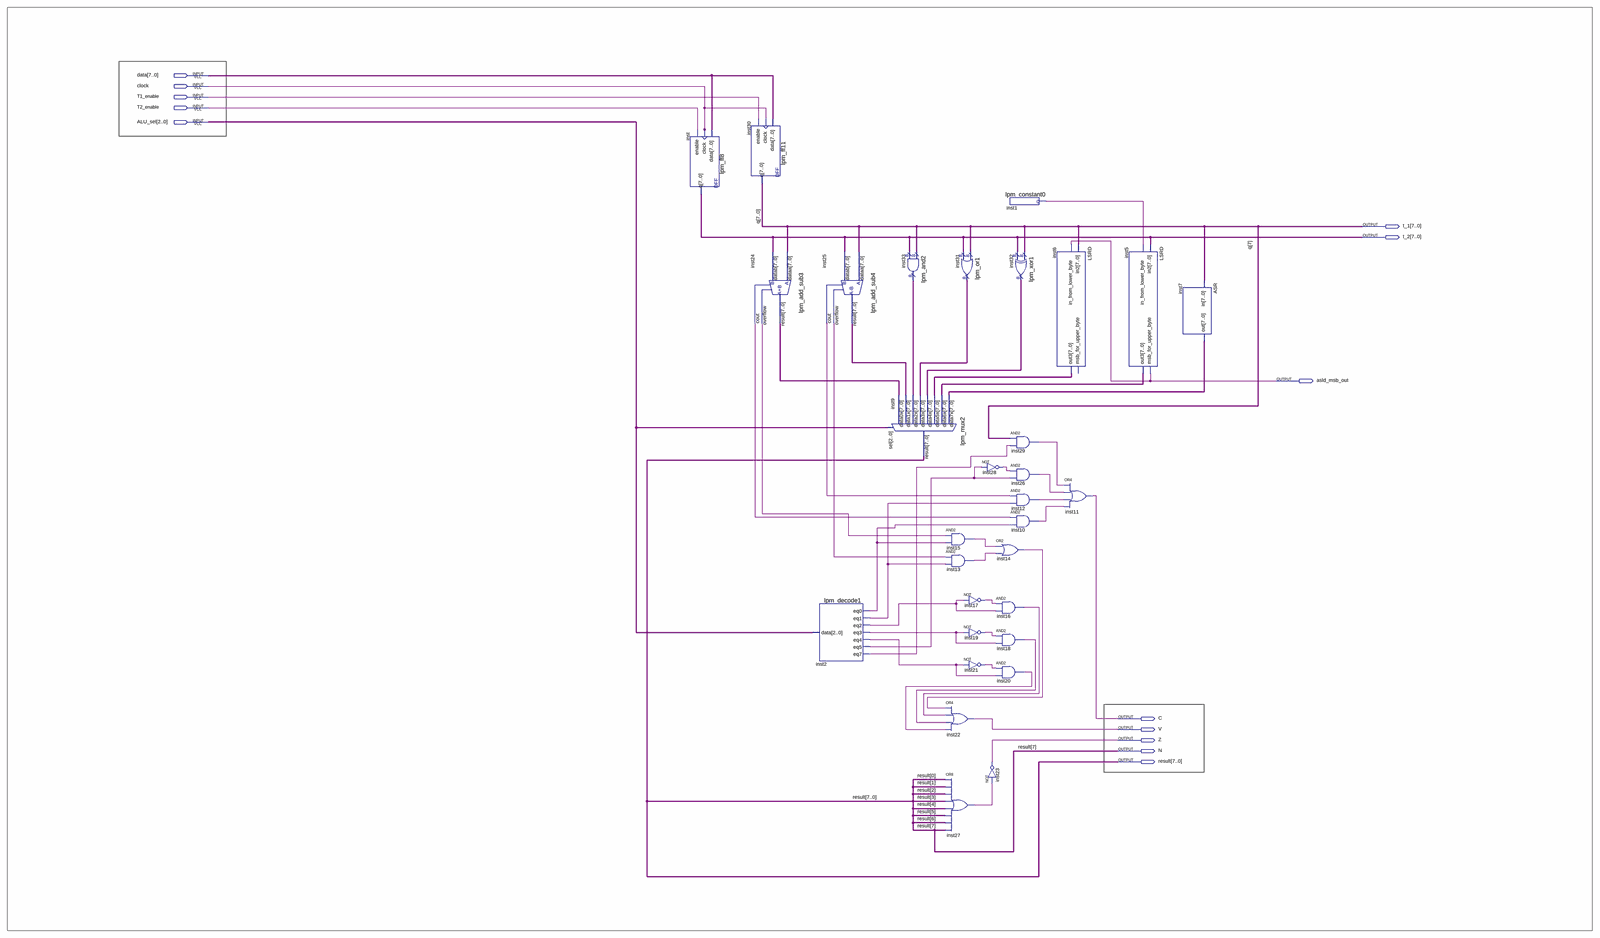
[diagram p0: schematic sheet, whole]
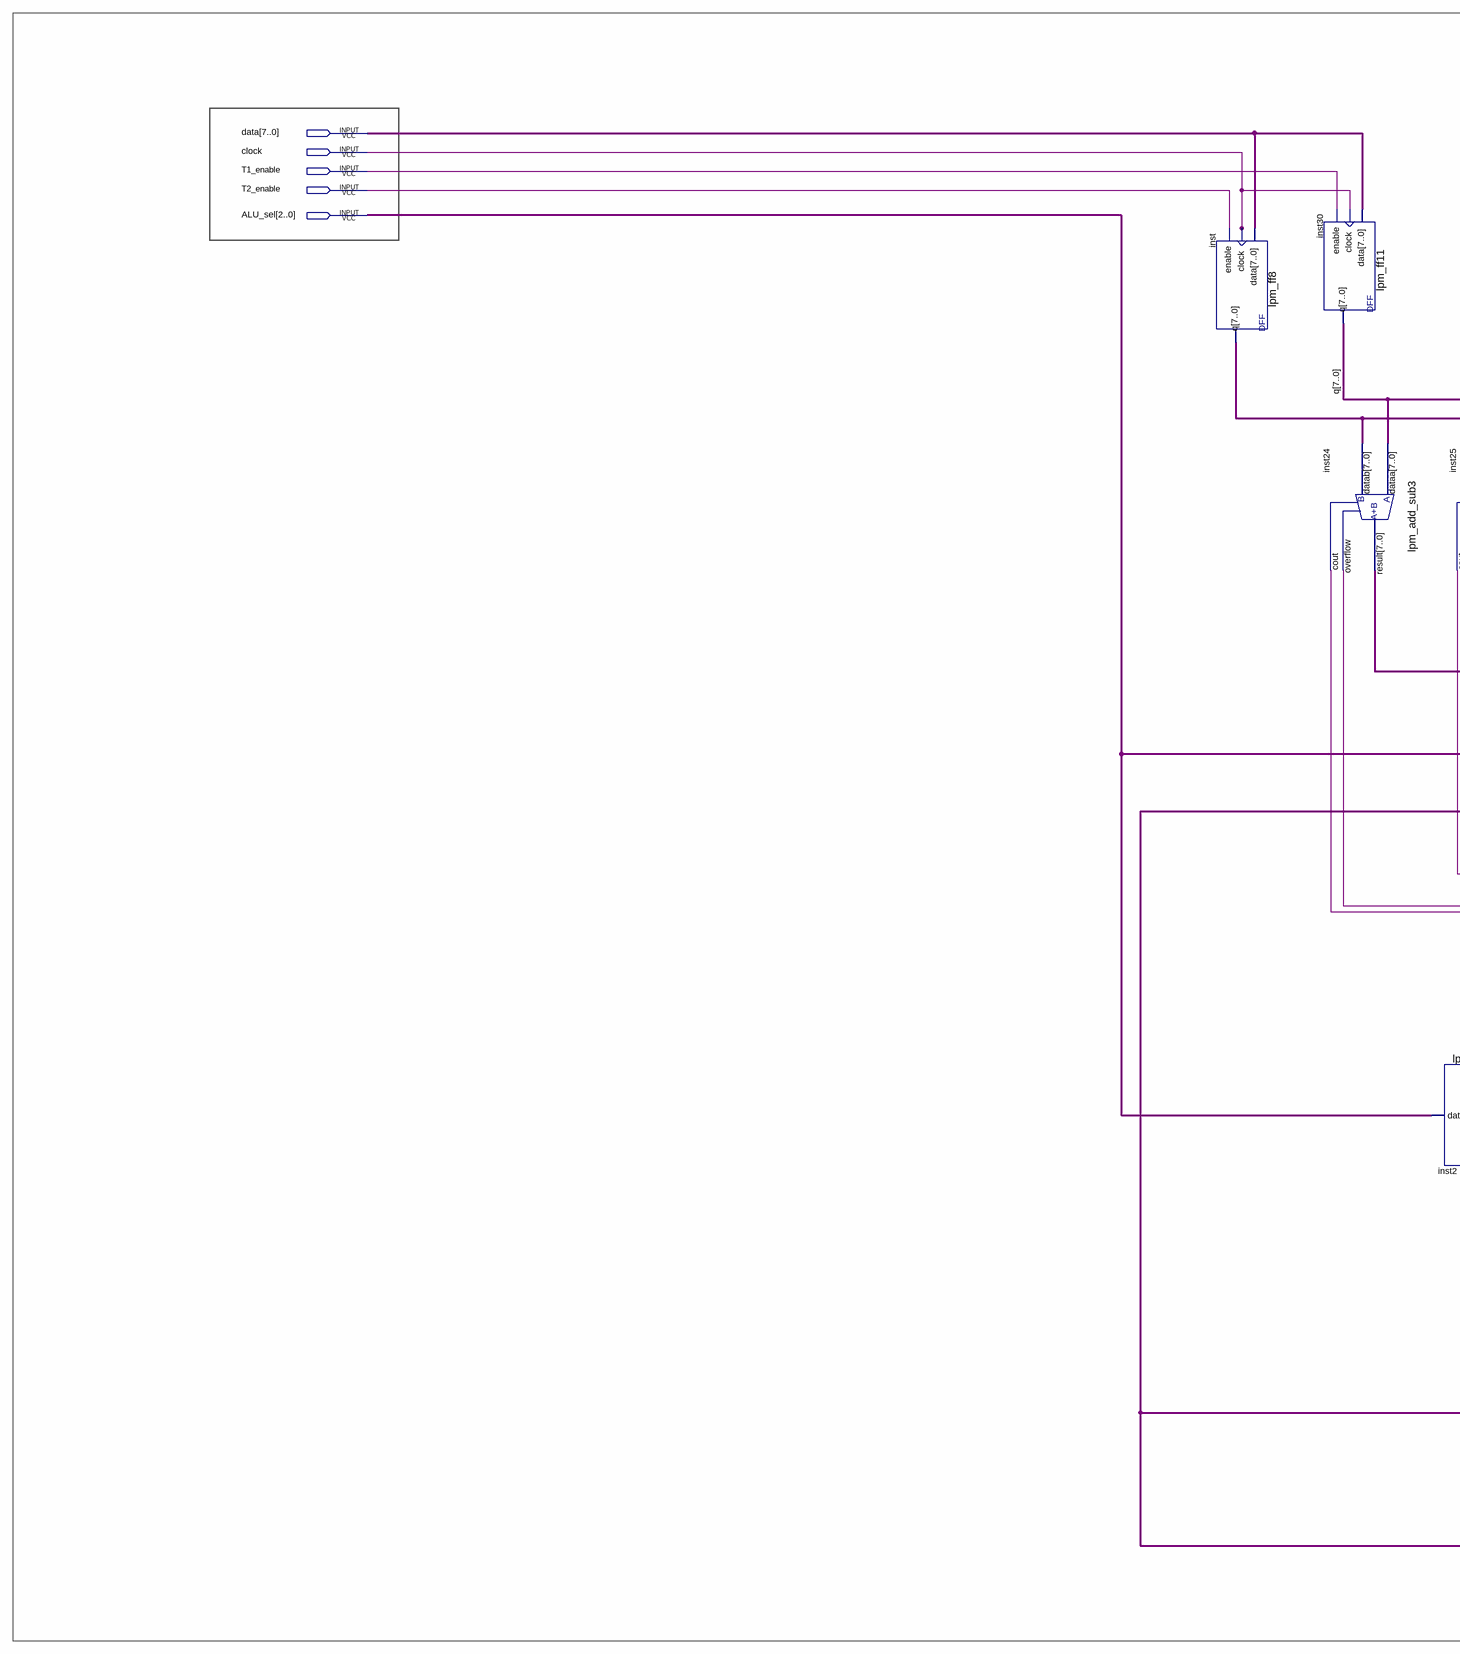
[diagram p1: schematic sheet, left part]
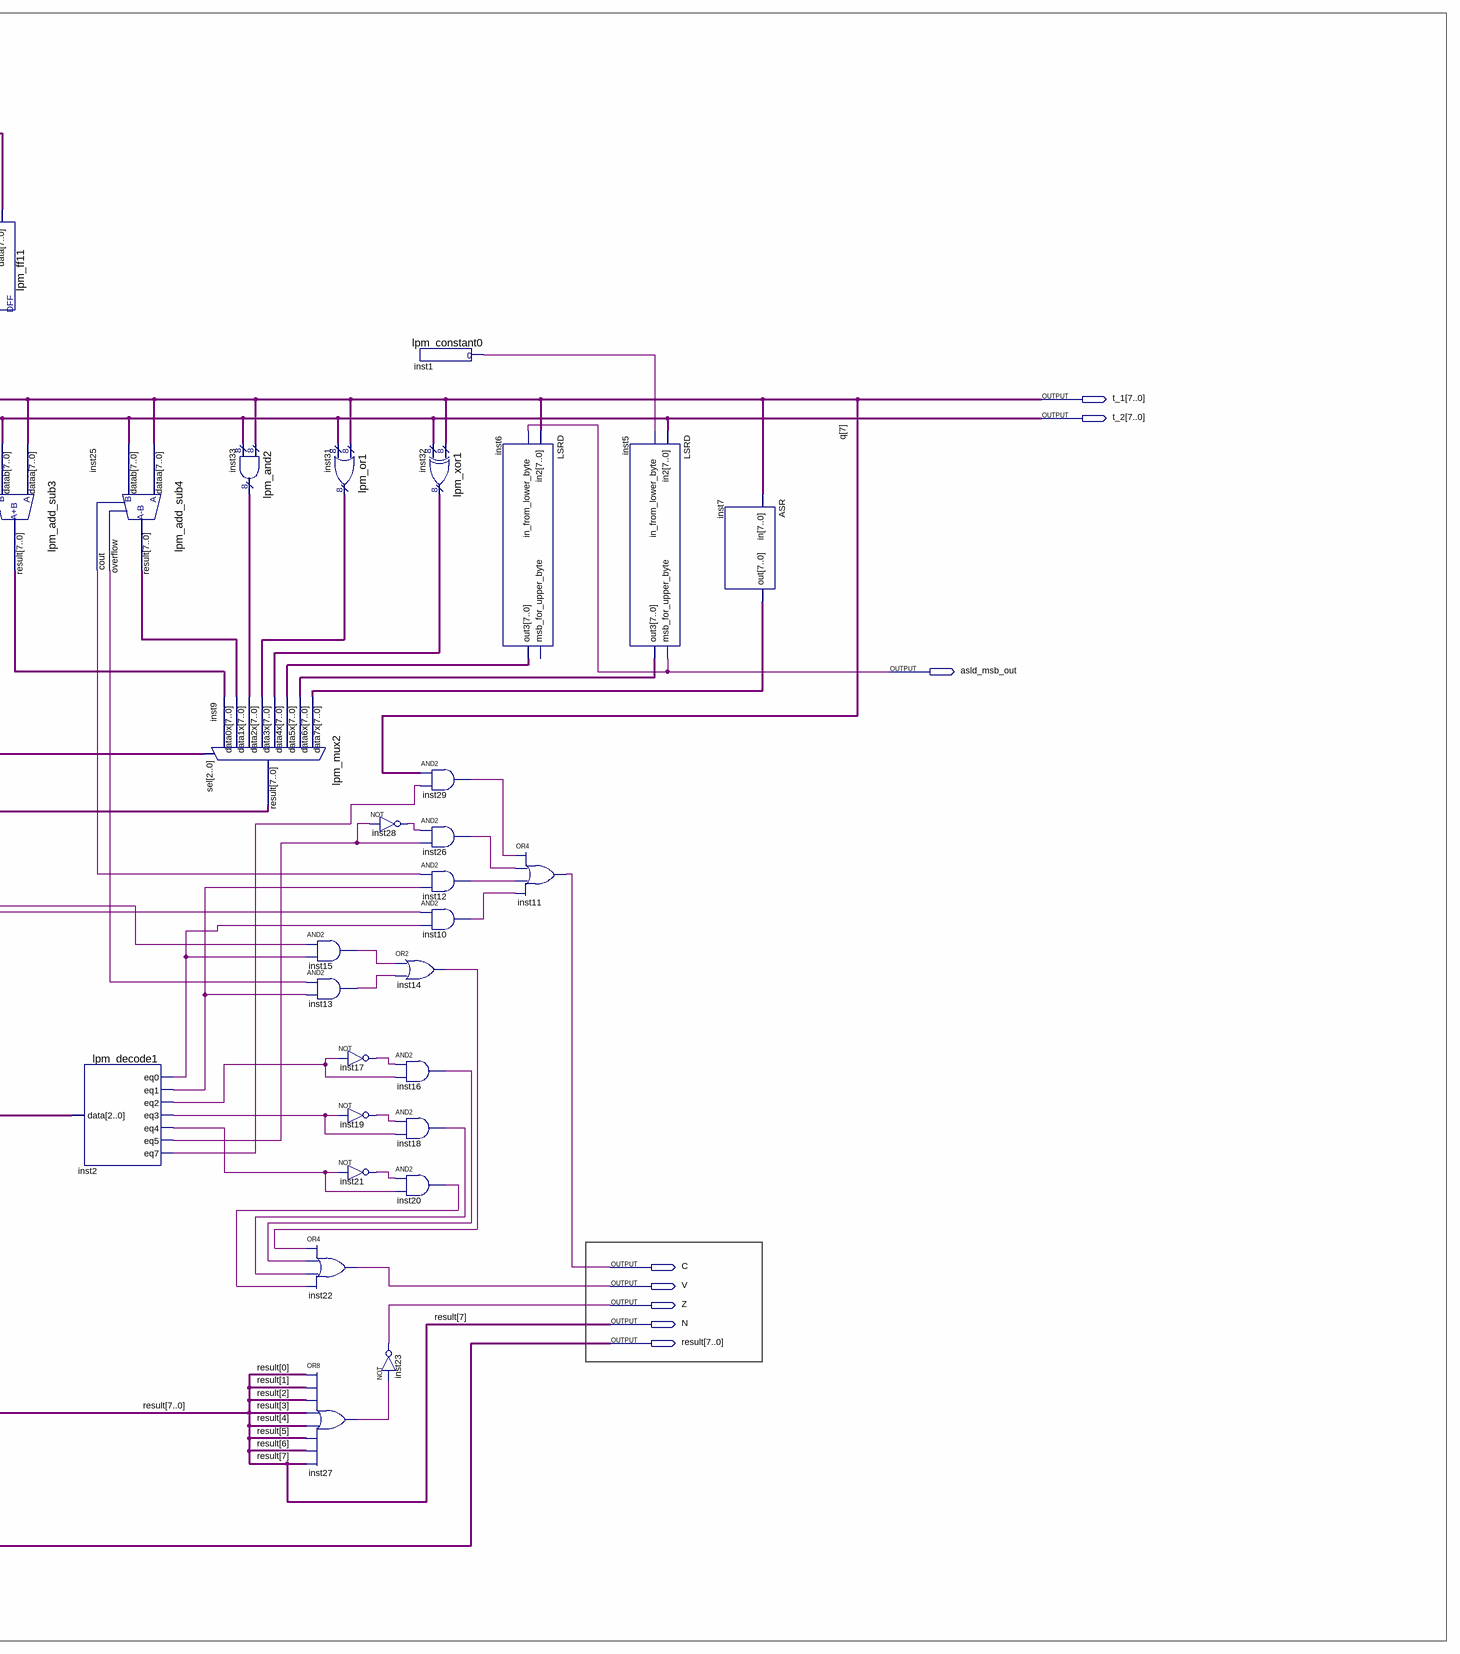
[diagram p2: schematic sheet, right part]
// Quartus schematic ALU.bdf as structural Verilog: 31 symbols, 13 pins
module ALU (
  input  [7:0] data,
  input  clock,
  input  T1_enable,
  input  T2_enable,
  input  [2:0] ALU_sel,
  output [7:0] t_1,
  output [7:0] t_2,
  output asld_msb_out,
  output C,
  output V,
  output Z,
  output N,
  output [7:0] result
);

  wire inst1_result, inst2_eq0, inst2_eq1, inst2_eq2, inst2_eq3, inst2_eq4, inst2_eq5, inst2_eq7, inst10_out,
       inst12_out, inst13_out, inst14_out, inst15_out, inst16_out, inst17_out, inst18_out, inst19_out,
       inst20_out, inst21_out, inst24_cout, inst24_overflow, inst25_cout, inst25_overflow, inst26_out,
       inst27_out, inst28_out, inst29_out;
  wire [7:0] inst5_out3, inst6_out3, inst7_out, inst24_result, inst25_result, inst31_result, inst32_result,
       inst33_result;

  lpm_ff8 inst (.data(data), .clock(clock), .enable(T2_enable), .q(t_2));
  lpm_ff11 inst30 (.data(data), .clock(clock), .enable(T1_enable), .q(t_1));
  lpm_add_sub3 inst24 (
    .dataa(t_1), .datab(t_2), .result(inst24_result), .overflow(inst24_overflow), .cout(inst24_cout));
  lpm_add_sub4 inst25 (
    .dataa(t_1), .datab(t_2), .result(inst25_result), .overflow(inst25_overflow), .cout(inst25_cout));
  lpm_decode1 inst2 (
    .data(ALU_sel), .eq0(inst2_eq0), .eq1(inst2_eq1), .eq2(inst2_eq2), .eq3(inst2_eq3), .eq4(inst2_eq4),
    .eq5(inst2_eq5), .eq7(inst2_eq7));
  lpm_and2 inst33 (.data0x(t_1), .data1x(t_2), .result(inst33_result));
  lpm_mux2 inst9 (
    .data7x(inst7_out), .data6x(inst5_out3), .data5x(inst6_out3), .data4x(inst32_result),
    .data3x(inst31_result), .data2x(inst33_result), .data1x(inst25_result), .data0x(inst24_result),
    .sel(ALU_sel), .result({N, result[6:0]}));
  lpm_or1 inst31 (.data0x(t_1), .data1x(t_2), .result(inst31_result));
  and inst15 (inst15_out, inst24_overflow, inst2_eq0);
  and inst13 (inst13_out, inst25_overflow, inst2_eq1);
  not inst17 (inst17_out, inst2_eq2);
  not inst19 (inst19_out, inst2_eq3);
  not inst21 (inst21_out, inst2_eq4);
  or inst22 (V, inst14_out, inst16_out, inst18_out, inst20_out);
  or inst27 (inst27_out, result[0], result[1], result[2], result[3], result[4], result[5], result[6], N);
  not inst28 (inst28_out, inst2_eq5);
  or inst14 (inst14_out, inst15_out, inst13_out);
  and inst16 (inst16_out, inst17_out, inst2_eq2);
  and inst18 (inst18_out, inst19_out, inst2_eq3);
  and inst20 (inst20_out, inst21_out, inst2_eq4);
  not inst23 (Z, inst27_out);
  lpm_constant0 inst1 (.result(inst1_result));
  lpm_xor1 inst32 (.data0x(t_1), .data1x(t_2), .result(inst32_result));
  and inst29 (inst29_out, t_1[7], inst2_eq7);
  and inst26 (inst26_out, inst28_out, inst2_eq5);
  and inst12 (inst12_out, inst25_cout, inst2_eq1);
  and inst10 (inst10_out, inst24_cout, inst2_eq0);
  LSRD inst6 (.in2(t_1), .in_from_lower_byte(asld_msb_out), .out3(inst6_out3));  // open: msb_for_upper_byte
  or inst11 (C, inst29_out, inst26_out, inst12_out, inst10_out);
  LSRD inst5 (.in2(t_2), .in_from_lower_byte(inst1_result), .msb_for_upper_byte(asld_msb_out), .out3(inst5_out3));
  ASR inst7 (.in(t_1), .out(inst7_out));

  assign result[7] = N;

  // Other names for the same wires on the sheet: q[7:0] = t_1
endmodule
